# Altium schematic sheet video.SchDoc
size A3
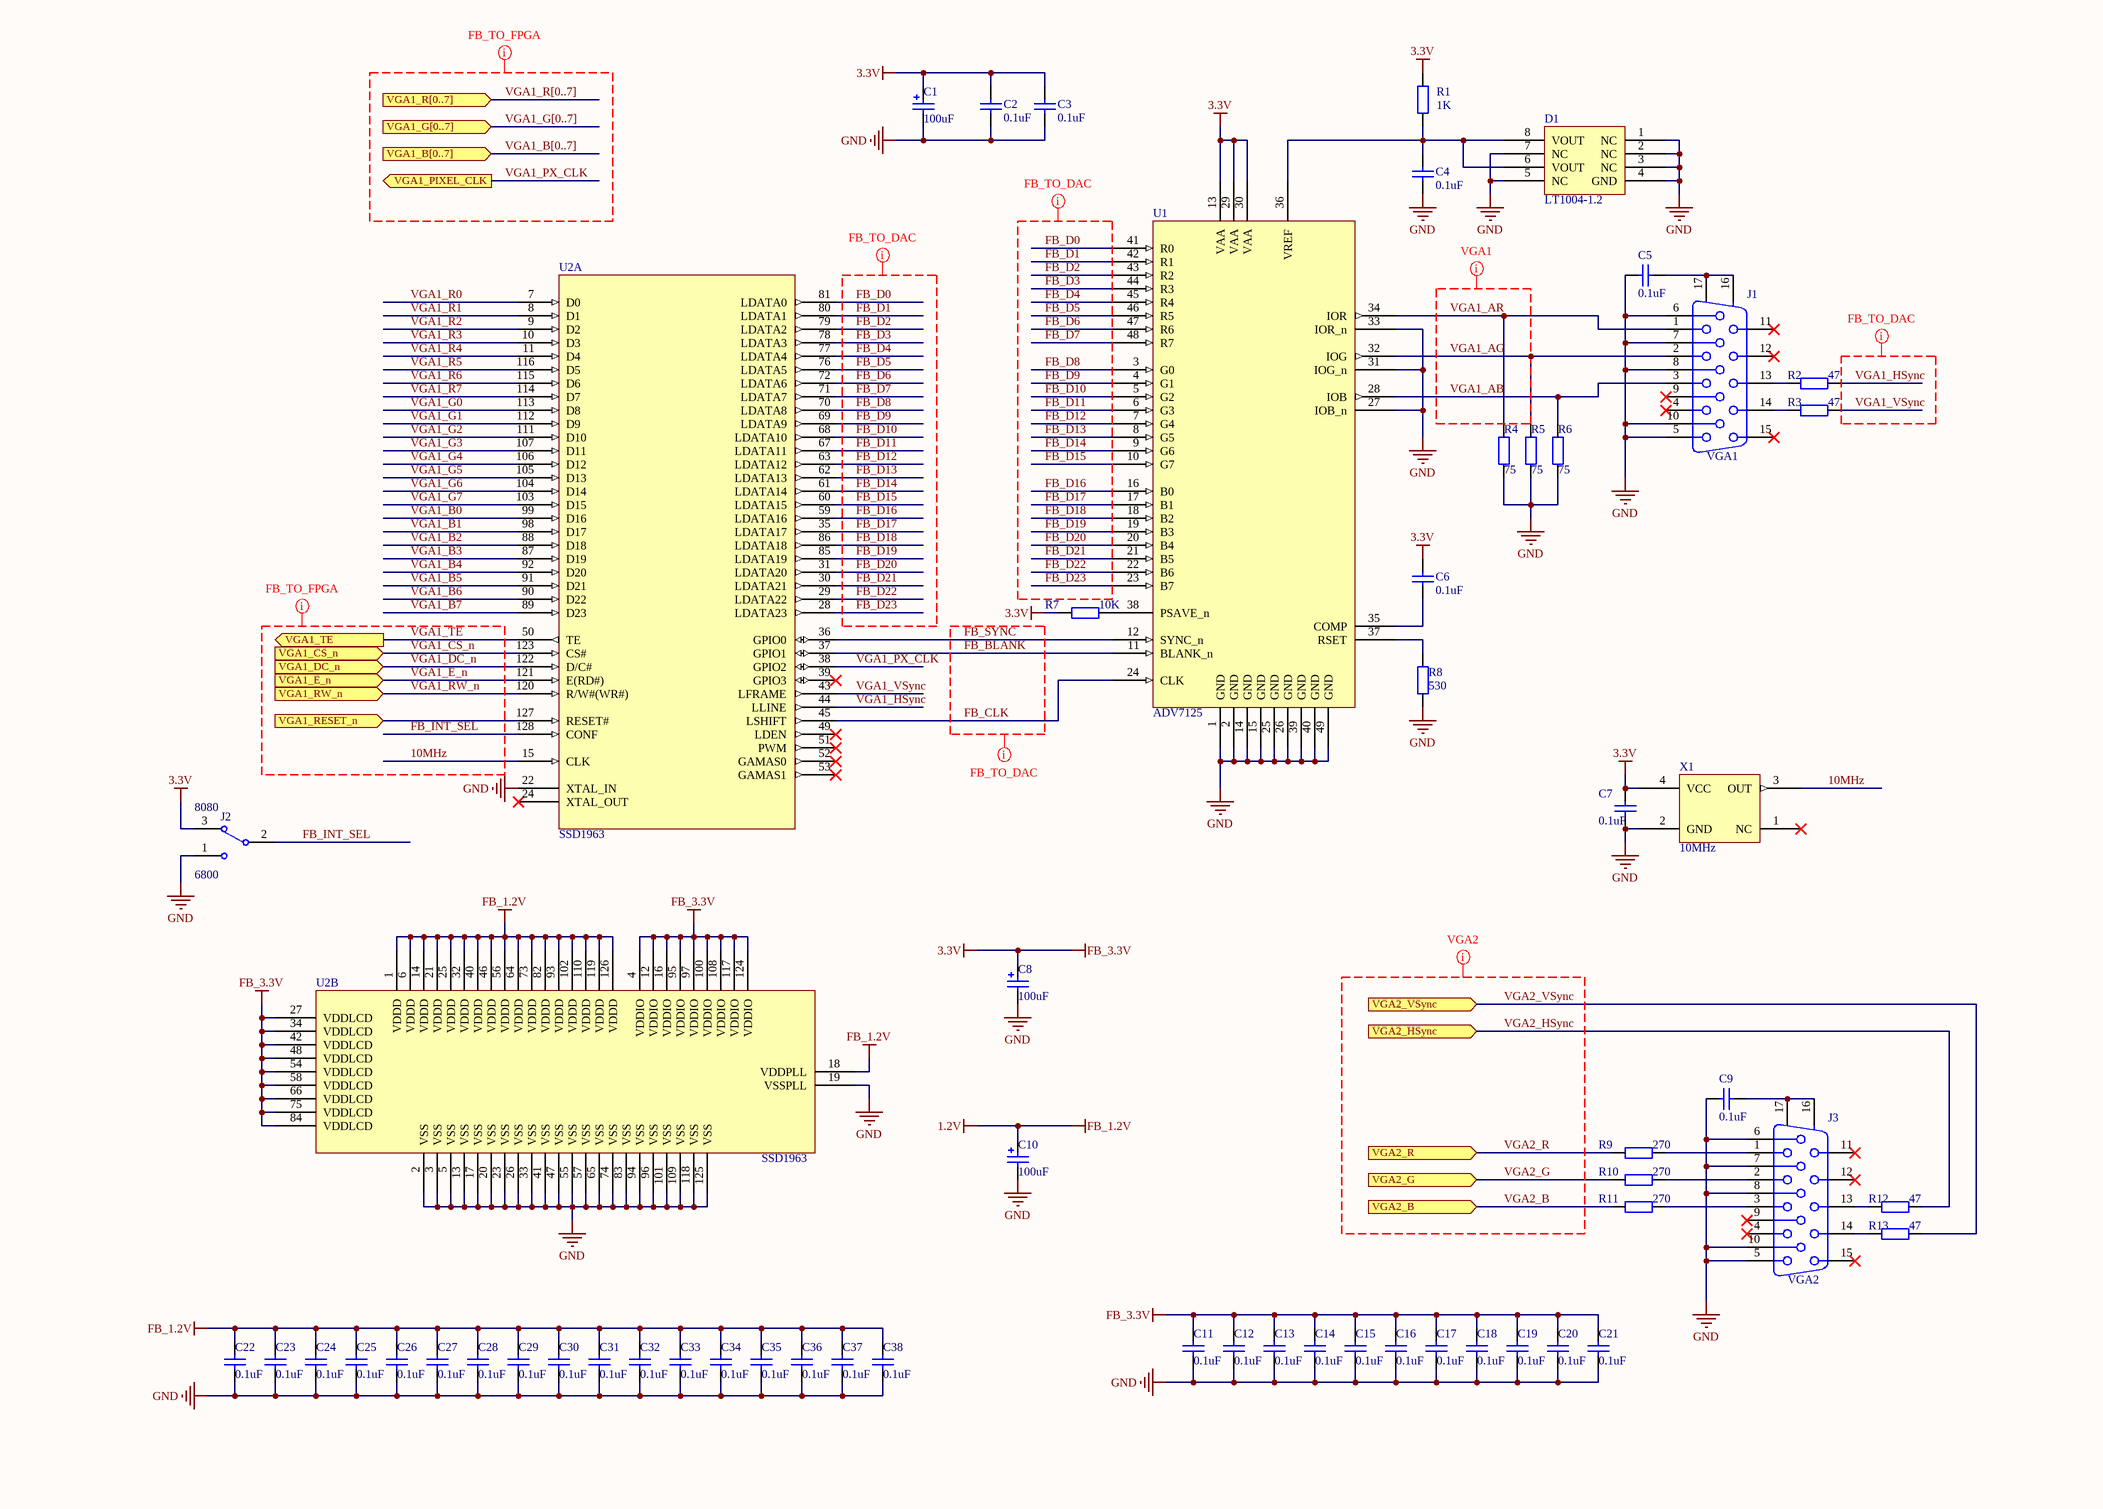
[diagram p0: video.SchDoc]

## Parts
C1  value 100uF  [C1206_POLARIZED]  (hidden comment: Cap Pol2)
C2  value 0.1uF  [0402]  (hidden comment: Cap)
C3  value 0.1uF  [0402]  (hidden comment: Cap)
C4  value 0.1uF  [0402]  (hidden comment: Cap)
C5  value 0.1uF  [0402]  (hidden comment: Cap)
C6  value 0.1uF  [0402]  (hidden comment: Cap)
C7  value 0.1uF  [0402]  (hidden comment: Cap)
C8  value 100uF  [C1206_POLARIZED]  (hidden comment: Cap Pol2)
C9  value 0.1uF  [0402]  (hidden comment: Cap)
C10  value 100uF  [C1206_POLARIZED]  (hidden comment: Cap Pol2)
C11  value 0.1uF  [0402]  (hidden comment: Cap)
C12  value 0.1uF  [0402]  (hidden comment: Cap)
C13  value 0.1uF  [0402]  (hidden comment: Cap)
C14  value 0.1uF  [0402]  (hidden comment: Cap)
C15  value 0.1uF  [0402]  (hidden comment: Cap)
C16  value 0.1uF  [0402]  (hidden comment: Cap)
C17  value 0.1uF  [0402]  (hidden comment: Cap)
C18  value 0.1uF  [0402]  (hidden comment: Cap)
C19  value 0.1uF  [0402]  (hidden comment: Cap)
C20  value 0.1uF  [0402]  (hidden comment: Cap)
C21  value 0.1uF  [0402]  (hidden comment: Cap)
C22  value 0.1uF  [0402]  (hidden comment: Cap)
C23  value 0.1uF  [0402]  (hidden comment: Cap)
C24  value 0.1uF  [0402]  (hidden comment: Cap)
C25  value 0.1uF  [0402]  (hidden comment: Cap)
C26  value 0.1uF  [0402]  (hidden comment: Cap)
C27  value 0.1uF  [0402]  (hidden comment: Cap)
C28  value 0.1uF  [0402]  (hidden comment: Cap)
C29  value 0.1uF  [0402]  (hidden comment: Cap)
C30  value 0.1uF  [0402]  (hidden comment: Cap)
C31  value 0.1uF  [0402]  (hidden comment: Cap)
C32  value 0.1uF  [0402]  (hidden comment: Cap)
C33  value 0.1uF  [0402]  (hidden comment: Cap)
C34  value 0.1uF  [0402]  (hidden comment: Cap)
C35  value 0.1uF  [0402]  (hidden comment: Cap)
C36  value 0.1uF  [0402]  (hidden comment: Cap)
C37  value 0.1uF  [0402]  (hidden comment: Cap)
C38  value 0.1uF  [0402]  (hidden comment: Cap)
D1  LT1004-1.2  [S8]
J1  VGA1  [VGA_Socket]
J2  FB_INTERFACE  [HDR1X3]  (value not drawn)
J3  VGA2  [VGA_Socket]
R1  value 1K  [J1-0603]  (hidden comment: Res2)
R2  value 47  [J1-0603]  (hidden comment: Res2)
R3  value 47  [J1-0603]  (hidden comment: Res2)
R4  value 75  [J1-0603]  (hidden comment: Res2)
R5  value 75  [J1-0603]  (hidden comment: Res2)
R6  value 75  [J1-0603]  (hidden comment: Res2)
R7  value 10K  [J1-0603]  (hidden comment: Res2)
R8  value 530  [J1-0603]  (hidden comment: Res2)
R9  value 270  [6-0805_N]  (hidden comment: Res2)
R10  value 270  [6-0805_N]  (hidden comment: Res2)
R11  value 270  [6-0805_N]  (hidden comment: Res2)
R12  value 47  [J1-0603]  (hidden comment: Res2)
R13  value 47  [J1-0603]  (hidden comment: Res2)
U1  ADV7125  [LFCSP_VQ48]
U2  SSD1963  [LQFP128-0.4]  (parts A,B of 2)
X1  10MHz  [FOX924]

## Ports
VGA1_B[0..7] (in), VGA1_CS_n (in), VGA1_DC_n (in), VGA1_E_n (in), VGA1_G[0..7] (in), VGA1_PIXEL_CLK (out), VGA1_R[0..7] (in), VGA1_RESET_n (in), VGA1_RW_n (in), VGA1_TE (out), VGA2_B (in), VGA2_G (in), VGA2_HSync (in), VGA2_R (in), VGA2_VSync (in)

## Nets
1.2V: C10.1 C22.1 C23.1 C24.1 C25.1 C26.1 C27.1 C28.1 C29.1 C30.1 C31.1 C32.1 C33.1 C34.1 C35.1 C36.1 C37.1 C38.1 U2.1(VDDD) U2.6(VDDD) U2.14(VDDD) U2.18(VDDPLL) U2.21(VDDD) U2.25(VDDD) U2.32(VDDD) U2.40(VDDD) U2.46(VDDD) U2.56(VDDD) U2.64(VDDD) U2.73(VDDD) U2.82(VDDD) U2.93(VDDD) U2.102(VDDD) U2.110(VDDD) U2.119(VDDD) U2.126(VDDD)  [also labelled FB_1.2V]
3.3V: C1.1 C2.2 C3.2 C6.2 C7.1 C8.1 C11.1 C12.1 C13.1 C14.1 C15.1 C16.1 C17.1 C18.1 C19.1 C20.1 C21.1 J2.3 R1.2 R7.1 U1.13(VAA) U1.29(VAA) U1.30(VAA) U2.4(VDDIO) U2.12(VDDIO) U2.16(VDDIO) U2.27(VDDLCD) U2.34(VDDLCD) U2.42(VDDLCD) U2.48(VDDLCD) U2.54(VDDLCD) U2.58(VDDLCD) U2.66(VDDLCD) U2.75(VDDLCD) U2.84(VDDLCD) U2.95(VDDIO) U2.97(VDDIO) U2.100(VDDIO) U2.108(VDDIO) U2.117(VDDIO) U2.124(VDDIO) X1.4(VCC)  [also labelled FB_3.3V]
GND: C1.2 C2.1 C3.1 C4.2 C5.1 C7.2 C8.2 C9.1 C10.2 C11.2 C12.2 C13.2 C14.2 C15.2 C16.2 C17.2 C18.2 C19.2 C20.2 C21.2 C22.2 C23.2 C24.2 C25.2 C26.2 C27.2 C28.2 C29.2 C30.2 C31.2 C32.2 C33.2 C34.2 C35.2 C36.2 C37.2 C38.2 D1.1(NC) D1.2(NC) D1.3(NC) D1.4(GND) D1.5(NC) D1.7(NC) J1.5 J1.6 J1.7 J1.8 J1.10 J2.1 J3.5 J3.6 J3.7 J3.8 J3.10 R4.1 R5.2 R6.2 R8.1 U1.1(GND) U1.2(GND) U1.14(GND) U1.15(GND) U1.25(GND) U1.26(GND) U1.27(IOB_n) U1.31(IOG_n) U1.33(IOR_n) U1.39(GND) U1.40(GND) U1.49(GND) U2.2(VSS) U2.3(VSS) U2.5(VSS) U2.13(VSS) U2.17(VSS) U2.19(VSSPLL) U2.20(VSS) U2.22(XTAL_IN) U2.23(VSS) U2.26(VSS) U2.33(VSS) U2.41(VSS) U2.47(VSS) U2.55(VSS) U2.57(VSS) U2.65(VSS) U2.74(VSS) U2.83(VSS) U2.94(VSS) U2.96(VSS) U2.101(VSS) U2.109(VSS) U2.118(VSS) U2.125(VSS) X1.2(GND)
10MHz: U2.15(CLK) X1.3(OUT)
FB_BLANK: U1.11(BLANK_n) U2.37(GPIO1)
FB_CLK: U1.24(CLK) U2.45(LSHIFT)
FB_D0: U1.41(R0) U2.81(LDATA0)
FB_D1: U1.42(R1) U2.80(LDATA1)
FB_D2: U1.43(R2) U2.79(LDATA2)
FB_D3: U1.44(R3) U2.78(LDATA3)
FB_D4: U1.45(R4) U2.77(LDATA4)
FB_D5: U1.46(R5) U2.76(LDATA5)
FB_D6: U1.47(R6) U2.72(LDATA6)
FB_D7: U1.48(R7) U2.71(LDATA7)
FB_D8: U1.3(G0) U2.70(LDATA8)
FB_D9: U1.4(G1) U2.69(LDATA9)
FB_D10: U1.5(G2) U2.68(LDATA10)
FB_D11: U1.6(G3) U2.67(LDATA11)
FB_D12: U1.7(G4) U2.63(LDATA12)
FB_D13: U1.8(G5) U2.62(LDATA13)
FB_D14: U1.9(G6) U2.61(LDATA14)
FB_D15: U1.10(G7) U2.60(LDATA15)
FB_D16: U1.16(B0) U2.59(LDATA16)
FB_D17: U1.17(B1) U2.35(LDATA17)
FB_D18: U1.18(B2) U2.86(LDATA18)
FB_D19: U1.19(B3) U2.85(LDATA19)
FB_D20: U1.20(B4) U2.31(LDATA20)
FB_D21: U1.21(B5) U2.30(LDATA21)
FB_D22: U1.22(B6) U2.29(LDATA22)
FB_D23: U1.23(B7) U2.28(LDATA23)
FB_INT_SEL: J2.2 U2.128(CONF)
FB_SYNC: U1.12(SYNC_n) U2.36(GPIO0)
VGA1_AB: J1.3 R6.1 U1.28(IOB)
VGA1_AG: J1.2 R5.1 U1.32(IOG)
VGA1_AR: J1.1 R4.2 U1.34(IOR)
VGA1_B0: U2.99(D16)
VGA1_B1: U2.98(D17)
VGA1_B2: U2.88(D18)
VGA1_B3: U2.87(D19)
VGA1_B4: U2.92(D20)
VGA1_B5: U2.91(D21)
VGA1_B6: U2.90(D22)
VGA1_B7: U2.89(D23)
VGA1_CS_n: U2.123(CS#) ; port VGA1_CS_n
VGA1_DC_n: U2.122(D/C#) ; port VGA1_DC_n
VGA1_E_n: U2.121(E(RD#)) ; port VGA1_E_n
VGA1_G0: U2.113(D8)
VGA1_G1: U2.112(D9)
VGA1_G2: U2.111(D10)
VGA1_G3: U2.107(D11)
VGA1_G4: U2.106(D12)
VGA1_G5: U2.105(D13)
VGA1_G6: U2.104(D14)
VGA1_G7: U2.103(D15)
VGA1_HSync: R2.2 U2.44(LLINE)
VGA1_PX_CLK: U2.38(GPIO2) ; port VGA1_PIXEL_CLK
VGA1_R0: U2.7(D0)
VGA1_R1: U2.8(D1)
VGA1_R2: U2.9(D2)
VGA1_R3: U2.10(D3)
VGA1_R4: U2.11(D4)
VGA1_R5: U2.116(D5)
VGA1_R6: U2.115(D6)
VGA1_R7: U2.114(D7)
VGA1_RESET_n: U2.127(RESET#) ; port VGA1_RESET_n
VGA1_RW_n: U2.120(R/W#(WR#)) ; port VGA1_RW_n
VGA1_TE: U2.50(TE) ; port VGA1_TE
VGA1_VSync: R3.2 U2.43(LFRAME)
VGA2_B: R11.2 ; port VGA2_B
VGA2_G: R10.2 ; port VGA2_G
VGA2_HSync: R12.2 ; port VGA2_HSync
VGA2_R: R9.2 ; port VGA2_R
VGA2_VSync: R13.2 ; port VGA2_VSync
NetC4_1: C4.1 D1.6(VOUT) D1.8(VOUT) R1.1 U1.36(VREF)
NetC5_2: C5.2 J1.16(MH1) J1.17(MH2)
NetC6_1: C6.1 U1.35(COMP)
NetC9_2: C9.2 J3.16(MH1) J3.17(MH2)
NetJ1_13: J1.13 R2.1
NetJ1_14: J1.14 R3.1
NetJ3_1: J3.1 R9.1
NetJ3_2: J3.2 R10.1
NetJ3_3: J3.3 R11.1
NetJ3_13: J3.13 R12.1
NetJ3_14: J3.14 R13.1
NetR7_2: R7.2 U1.38(PSAVE_n)
NetR8_2: R8.2 U1.37(RSET)

Not connected (* = marked no-connect by the designer): J1 4* 9* 11* 12* 15*; J3 4* 9* 11* 12* 15*; U2 24(XTAL_OUT)* 39(GPIO3)* 49(LDEN)* 51(PWM)* 52(GAMAS0)* 53(GAMAS1)*; X1 1(NC)*

## Buses and harness runs
bus VGA1_B[0..7] = port VGA1_B[0..7]
bus VGA1_G[0..7] = port VGA1_G[0..7]
bus VGA1_R[0..7] = port VGA1_R[0..7]

## Layout directives
net class FB_TO_DAC: FB_BLANK, FB_CLK, FB_D0, FB_D1, FB_D2, FB_D3, FB_D4, FB_D5, FB_D6, FB_D7, FB_D8, FB_D9, FB_D10, FB_D11, FB_D12, FB_D13, FB_D14, FB_D15, FB_D16, FB_D17, FB_D18, FB_D19, FB_D20, FB_D21, FB_D22, FB_D23, FB_SYNC, VGA1_HSync, VGA1_VSync
net class FB_TO_FPGA: 10MHz, FB_INT_SEL, VGA1_B[0..7], VGA1_CS_n, VGA1_DC_n, VGA1_E_n, VGA1_G[0..7], VGA1_PX_CLK, VGA1_R[0..7], VGA1_RW_n, VGA1_TE
net class VGA2: VGA2_B, VGA2_G, VGA2_HSync, VGA2_R, VGA2_VSync
net class VGA1: VGA1_AB, VGA1_AG, VGA1_AR

## Notes on the sheet
- (near J2) 8080
- (near J2) 6800
- Title
- Size:
- Date:
- A3
- Number:
- Time:
- Revision:
- Sheet
- of
- File:

## Library data of the parts
C1 C8 C10 = Cap Pol2: Polarized Capacitor (Axial); Published: 8-Jun-2000; LatestRevisionDate: 17-Jul-2002; LatestRevisionNote: Re-released for DXP Platform.; PackageReference: POLAR0.8; Publisher: Altium Limited; PackageDescription: Polarized Capacitor; 2 Leads
C2-C7 C9 C11-C38 = Cap: Capacitor; Published: 8-Jun-2000; LatestRevisionDate: 17-Jul-2002; LatestRevisionNote: Re-released for DXP Platform.; PackageReference: RAD-0.3; Publisher: Altium Limited; PackageDescription: Radial Cap, Thru-Hole; 2 Leads; 0.3 in Pin Spacing
J1 J3 = Connector 15: Receptacle Assembly, 15-Pin, Sim Line Connector; PackageDocument: B; Positions: 15; Gender: Female; Orientation: Right Angle
J2 = SW-SPDT: Published: 24-Mar-1999; LatestRevisionDate: 17-Dec-2003; LatestRevisionNote: Schematic revised, PCB Footprint replaced.; DatasheetVersion: 05-Dec-2000; PackageReference: TL36WW15050; Publisher: Altium Limited; PackageDescription: Switch; 4 Leads; ComponentLink1Description: Manufacturer Link; ComponentLink1URL: http://www.apem.com
R1-R13 = Res2: Resistor; Published: 8-Jun-2000; LatestRevisionDate: 17-Jul-2002; LatestRevisionNote: Re-released for DXP Platform.; PackageReference: AXIAL-0.4; Publisher: Altium Limited; PackageDescription: Axial Device, Thru-Hole; 2 Leads; 0.4 in Pin Spacing
X1 = FOX924B-10MHz